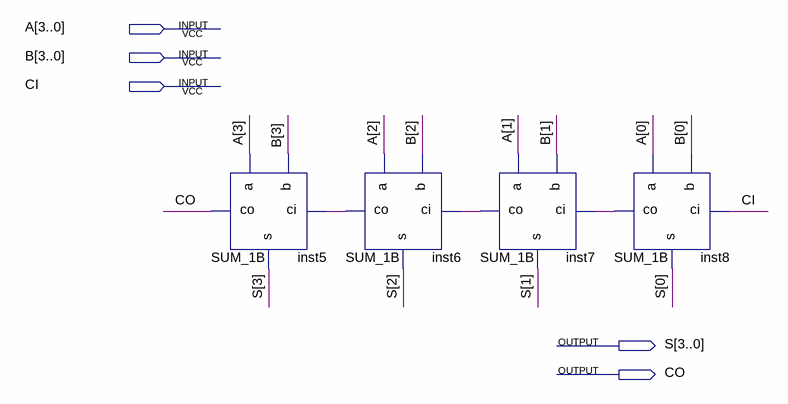
[diagram p0: schematic sheet]
// Quartus schematic SUM_4B.bdf as structural Verilog: 4 symbols, 5 pins
module SUM_4B (
  input  [3:0] A,
  input  [3:0] B,
  input  CI,
  output [3:0] S,
  output CO
);

  wire inst6_co, inst7_co, inst8_co;

  SUM_1B inst5 (.a(A[3]), .b(B[3]), .ci(inst6_co), .s(S[3]), .co(CO));
  SUM_1B inst6 (.a(A[2]), .b(B[2]), .ci(inst7_co), .s(S[2]), .co(inst6_co));
  SUM_1B inst7 (.a(A[1]), .b(B[1]), .ci(inst8_co), .s(S[1]), .co(inst7_co));
  SUM_1B inst8 (.a(A[0]), .b(B[0]), .ci(CI), .s(S[0]), .co(inst8_co));
endmodule
